# EasyEDA schematic easyeda-schematic.json
TITLE: RFID access control circuit; REV: 1.0; Date: 2020-06-28; Sheet: 1/1; Drawn By: fuzziqersoftware
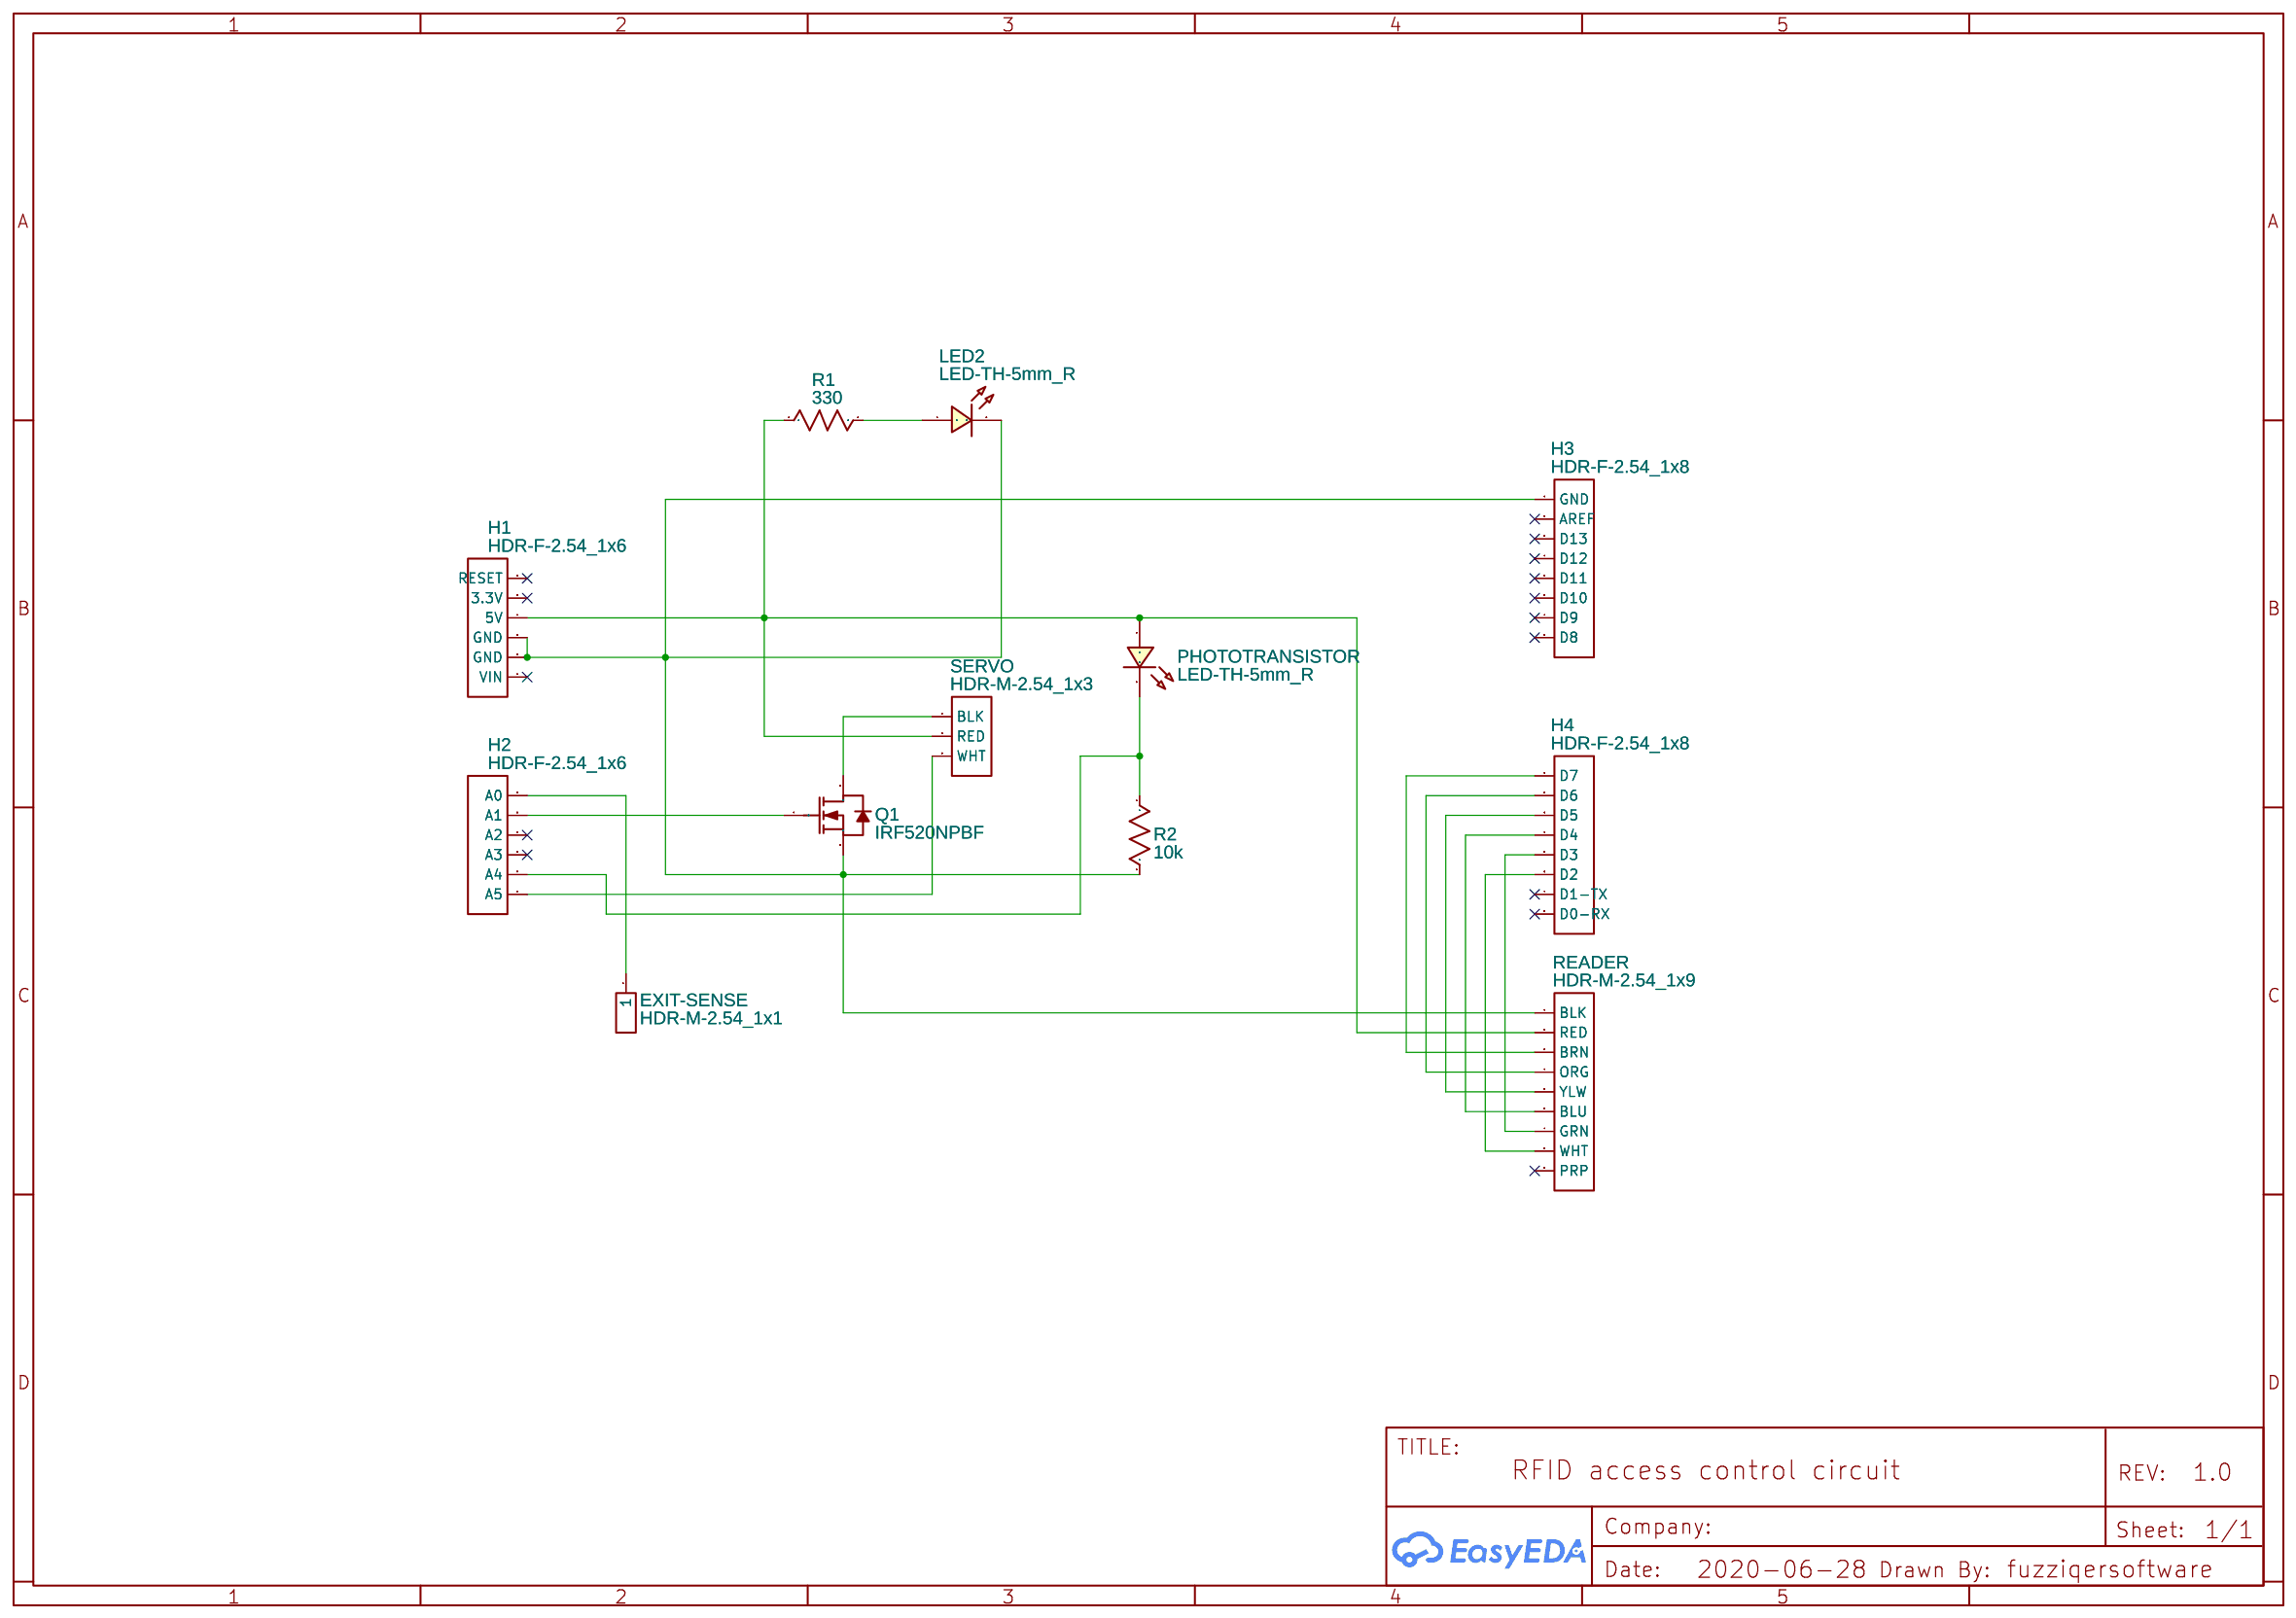
[diagram p0: schematic sheet]

## Parts
EXIT-SENSE  HDR-M-2.54_1x1  [HDR-M-2.54_1X1]
H1  HDR-F-2.54_1x6  [HDR-F-2.54_1X6]
H2  HDR-F-2.54_1x6  [HDR-F-2.54_1X6]
H3  HDR-F-2.54_1x8  [HDR-F-2.54_1X8]
H4  HDR-F-2.54_1x8  [HDR-F-2.54_1X8]
LED2  LED-TH-5mm_R  [LED-TH_BD5.0_RED]
PHOTOTRANSISTOR  LED-TH-5mm_R  [LED-TH_BD5.0_RED]
Q1  IRF520NPBF  [TO-220-3_L10.0-W4.5-P2.54-T]
R1  330  [R_AXIAL-0.4]
R2  10k  [R_AXIAL-0.4]
READER  HDR-M-2.54_1x9  [HDR-M-2.54_1X9]
SERVO  HDR-M-2.54_1x3  [HDR-M-2.54_1X3]

## Library data of the parts
EXIT-SENSE = HDR-M-2.54_1x1: Supplier Part: C81276; Supplier: LCSC; Contributor: LCEDA_Lib
H1 H2 = HDR-F-2.54_1x6: Supplier Part: C40877; Supplier: LCSC; Contributor: LCEDA_Lib
H3 H4 = HDR-F-2.54_1x8: Supplier Part: C225505; Supplier: LCSC; Contributor: LCEDA_Lib
LED2 PHOTOTRANSISTOR = LED-TH-5mm_R: Manufacturer: EVERLIGHT(台湾亿光); Manufacturer Part: 333-2SURD/S530-A3; Supplier Part: C87271; Supplier: LCSC; Contributor: LCEDA_Lib
Q1 = IRF520NPBF: Supplier: LCSC; Manufacturer: IR; Supplier Part: C2598
R1 R2 = R_AXIAL-0.4_US: Contributor: LCEDA_Lib
READER = HDR-M-2.54_1x9: Supplier Part: C225484; Supplier: LCSC; Contributor: LCEDA_Lib
SERVO = HDR-M-2.54_1x3: Supplier Part: C180248; Supplier: LCSC; Contributor: LCEDA_Lib

## Nets
Net-(EXIT-SENSE-1): EXIT-SENSE.1 H2.6(A0)
Net-(H1-2): H1.2(GND) H1.3(GND) H3.1(GND) LED2.2 Q1.3(S) R2.2 READER.1(BLK)
Net-(H1-4): H1.4(5V) PHOTOTRANSISTOR.1 R1.1 READER.2(RED) SERVO.2(RED)
Net-(H2-1): H2.1(A5) SERVO.3(WHT)
Net-(H2-2): H2.2(A4) PHOTOTRANSISTOR.2 R2.1
Net-(H2-5): H2.5(A1) Q1.1(G)
Net-(H4-1): H4.1(D7) READER.3(BRN)
Net-(H4-2): H4.2(D6) READER.4(ORG)
Net-(H4-3): H4.3(D5) READER.5(YLW)
Net-(H4-4): H4.4(D4) READER.6(BLU)
Net-(H4-5): H4.5(D3) READER.7(GRN)
Net-(H4-6): H4.6(D2) READER.8(WHT)
Net-(LED2-1): LED2.1 R1.2
Net-(Q1-2): Q1.2(D) SERVO.1(BLK)

Not connected (* = marked no-connect by the designer): H1 1(VIN)* 5(3.3V)* 6(RESET)*; H2 3(A3)* 4(A2)*; H3 2(AREF)* 3(D13)* 4(D12)* 5(D11)* 6(D10)* 7(D9)* 8(D8)*; H4 7(D1-TX)* 8(D0-RX)*; READER 9(PRP)*
